# EasyEDA Pro project 通信扩展spi_usb_iic.epro

# Schematic 通信扩展spi_usb_iic

## Sheets
1 USB: Board Name: 通信板扩展; Create Date: 2025-05-26; Page Name: USB; Project Name: stm32f407zgTx系统板V2.0（自画 10mil）; Schematic Name: Schematic3; Update Date: 2025-06-02; Company: 嘉立创EDA; Page Size: A4; Version: V1.0
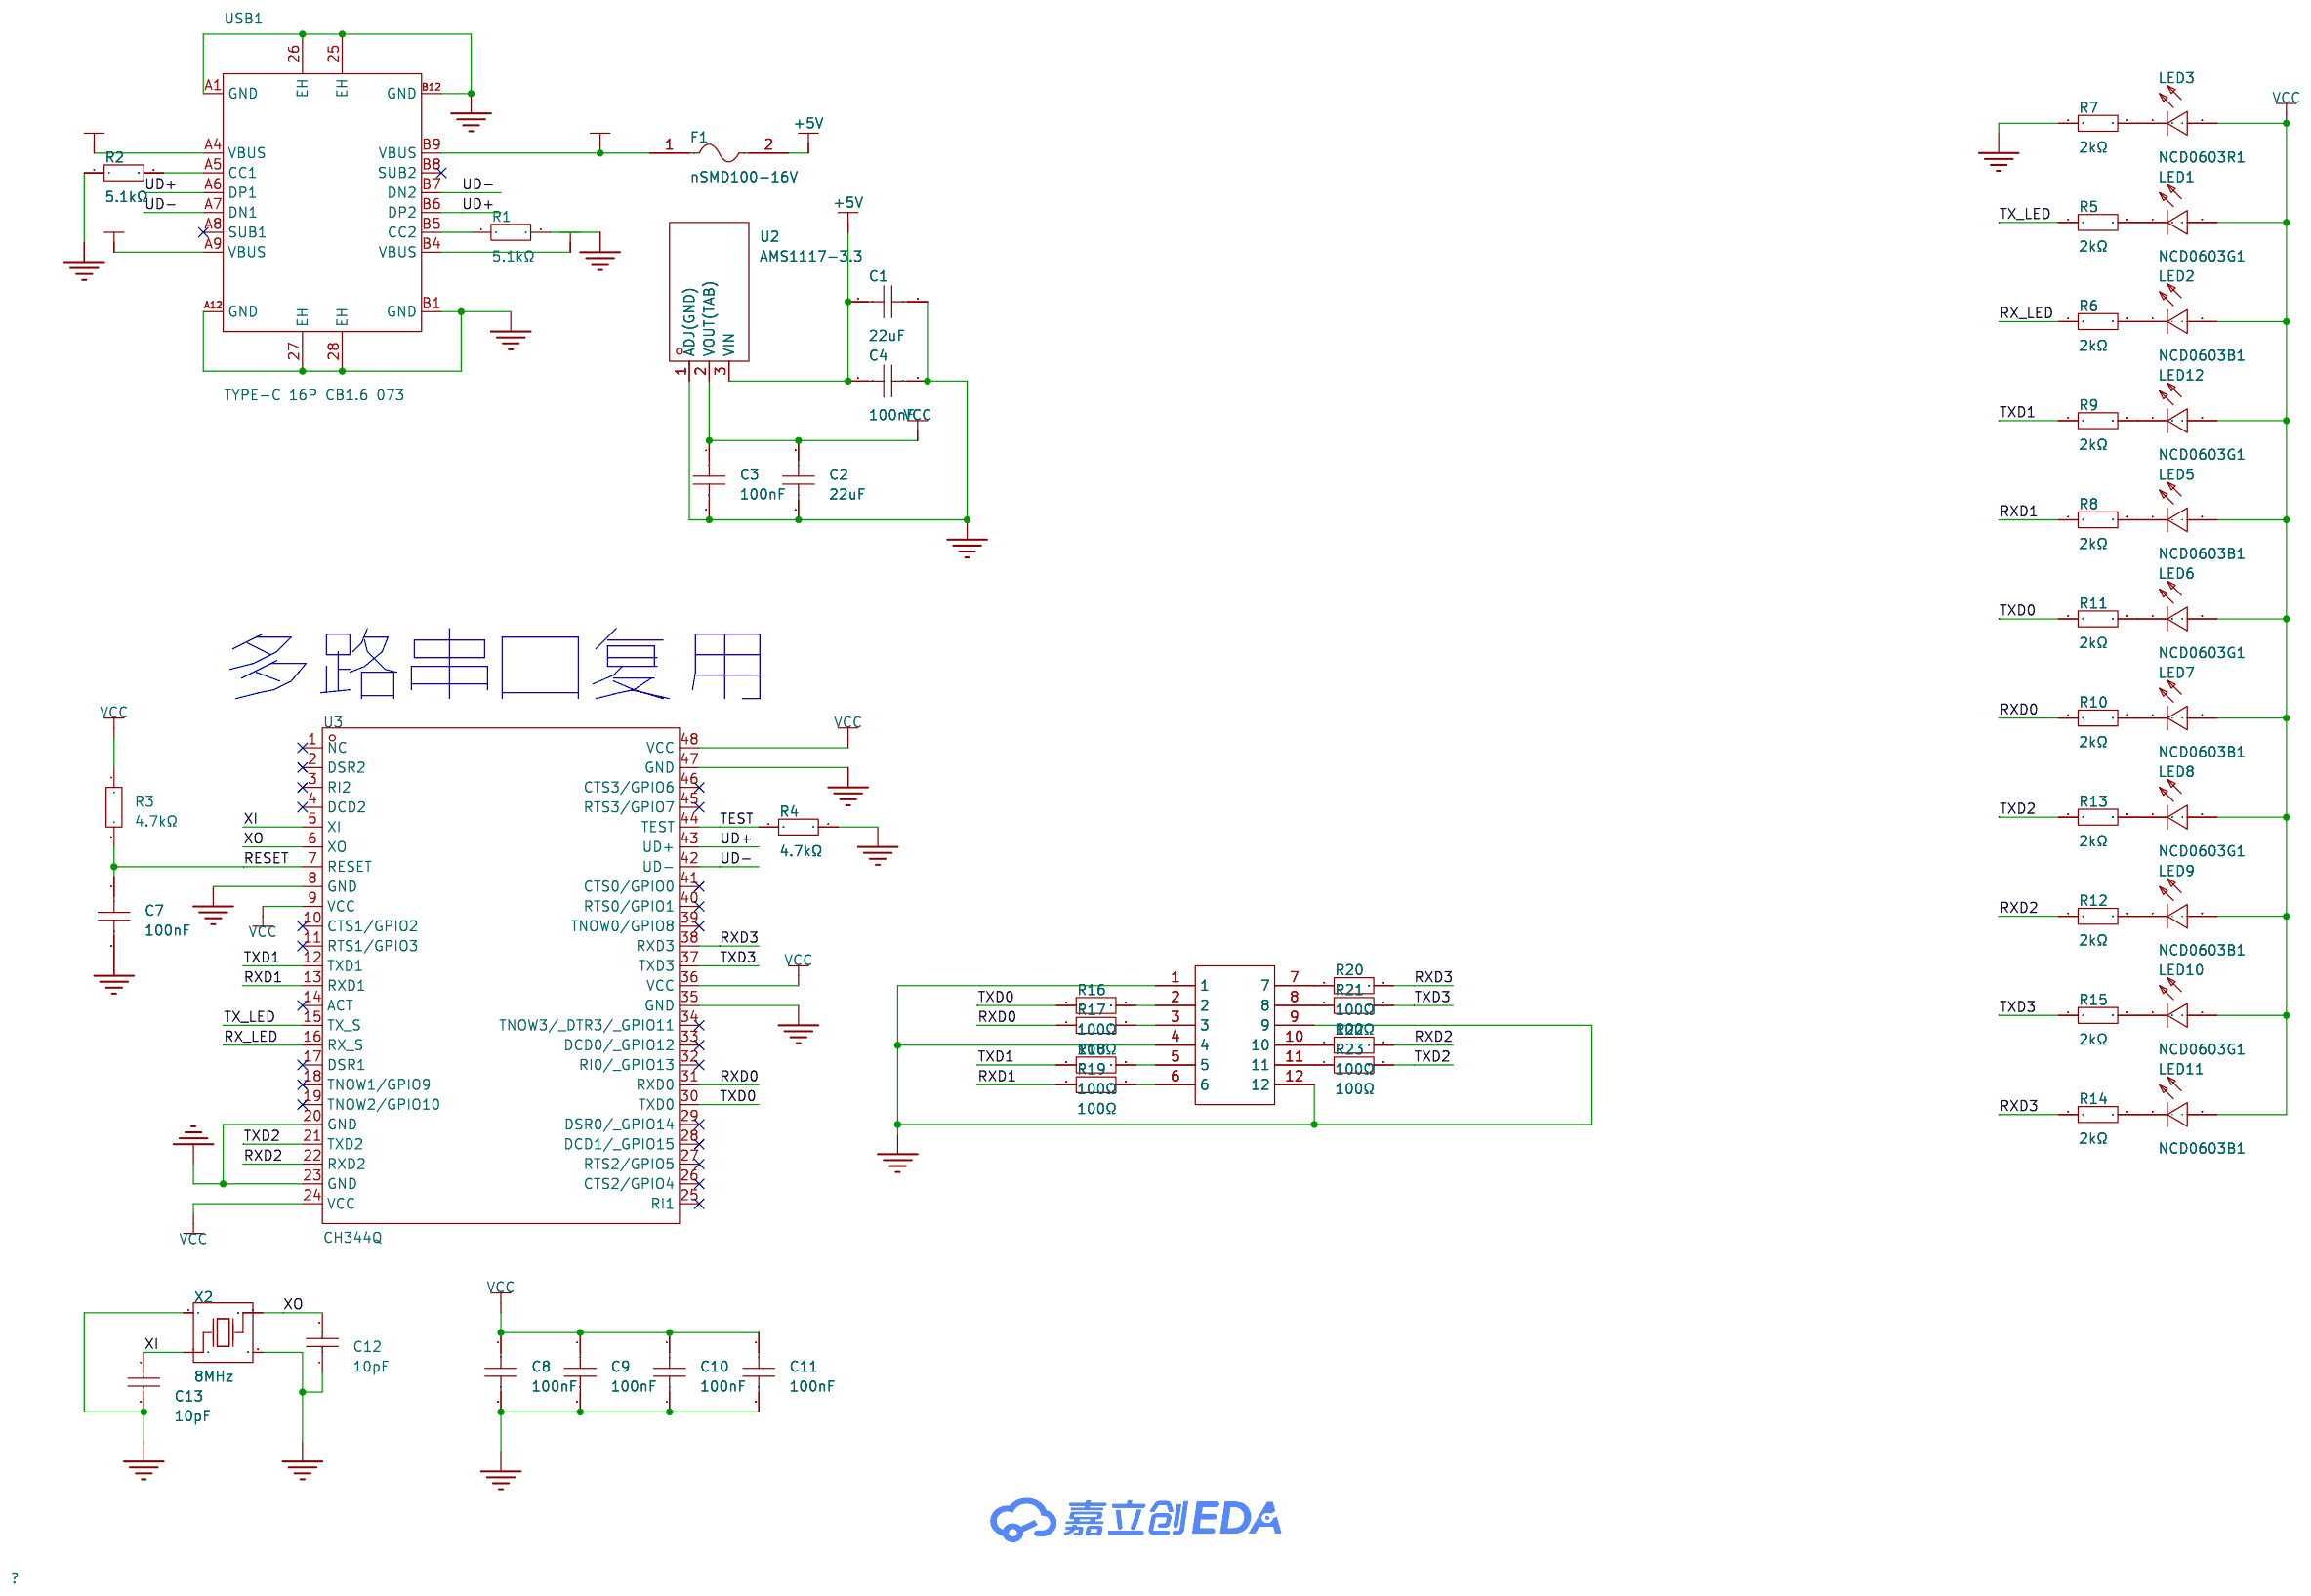
[diagram p0: USB]
2 IIC: Create Date: 2025-06-02; Page Name: IIC
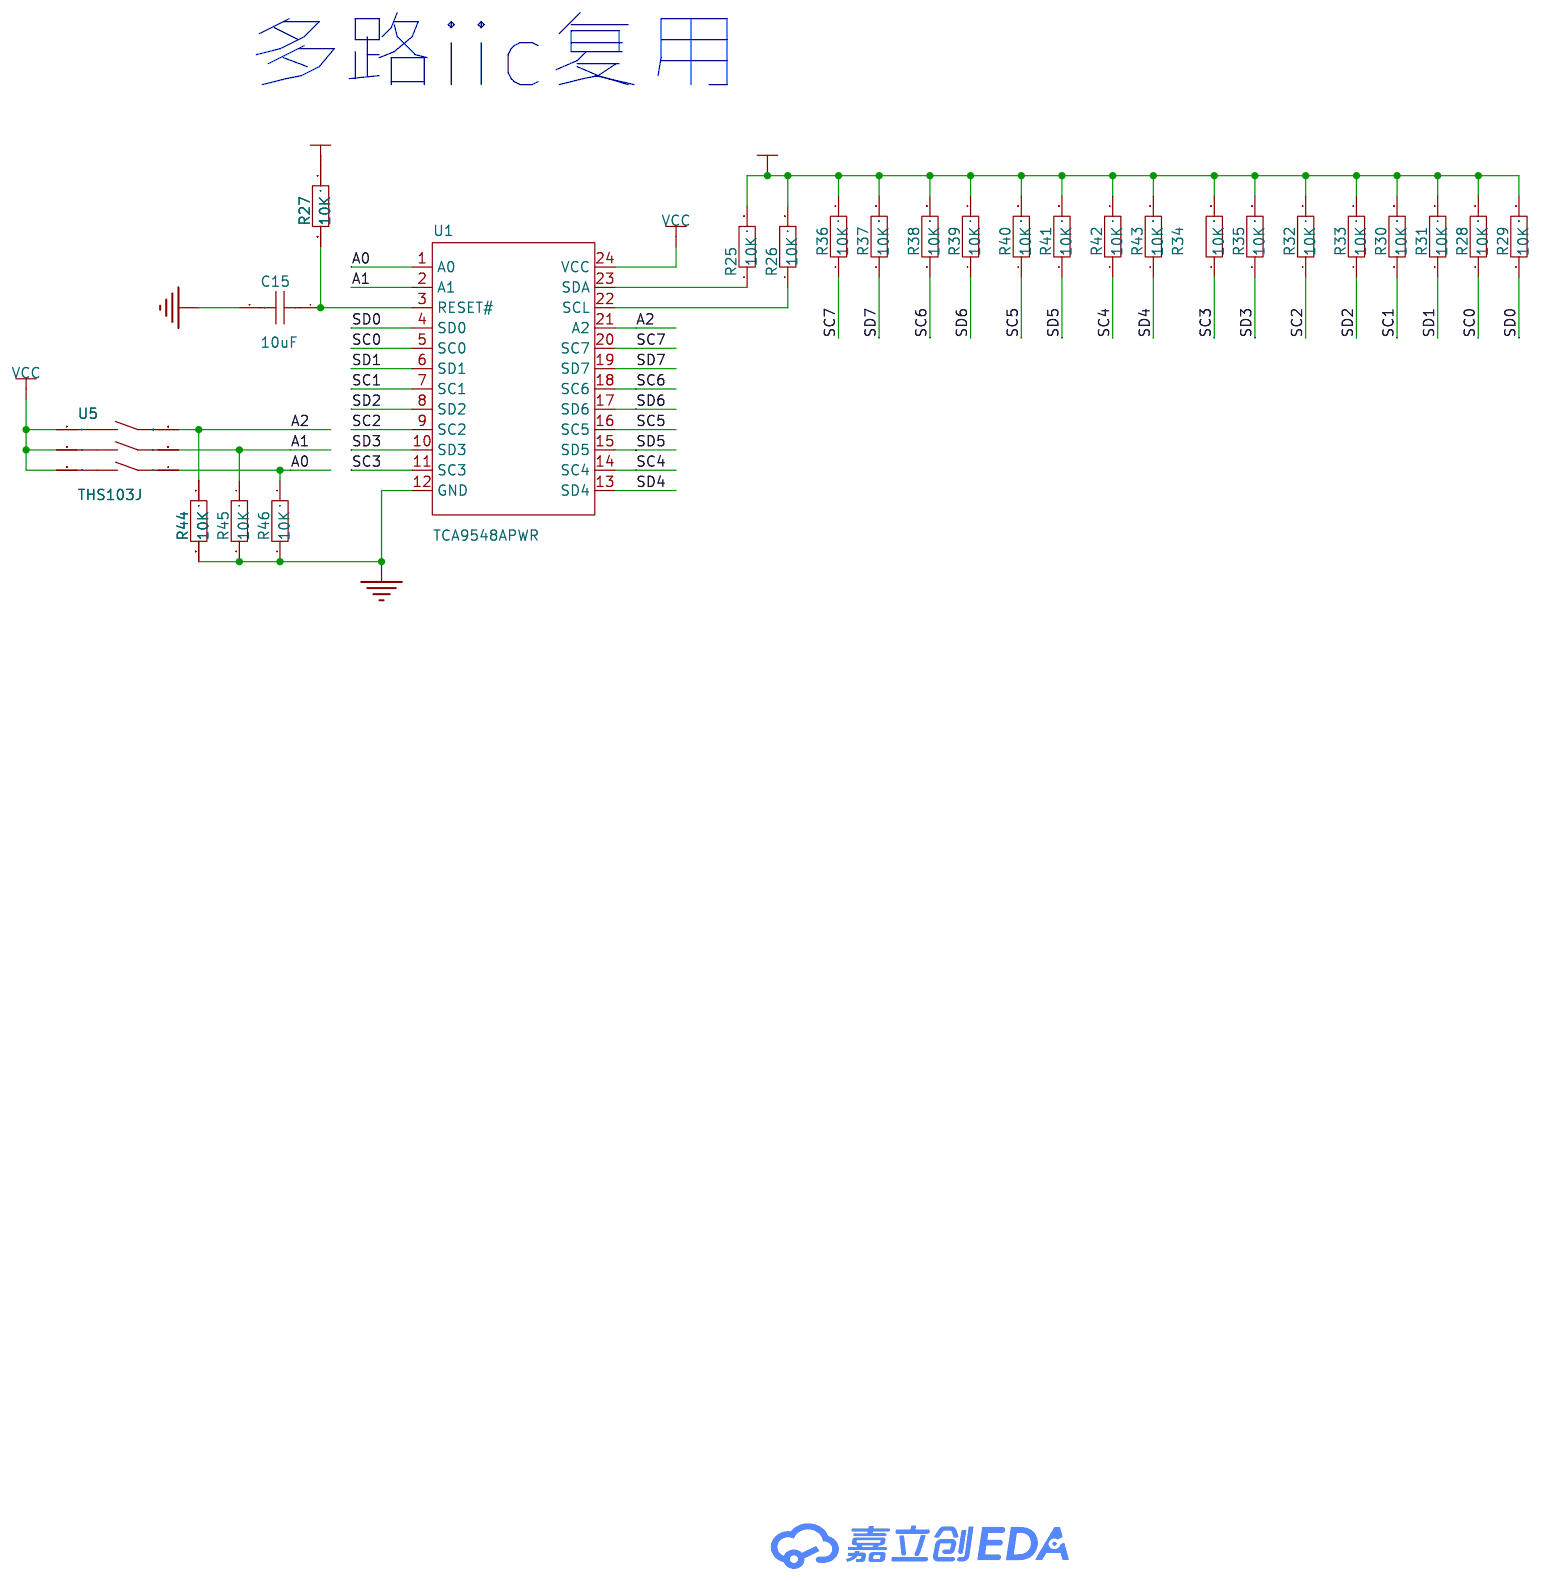
[diagram p1: IIC]
3 SPI: Create Date: 2025-06-02; Page Name: SPI
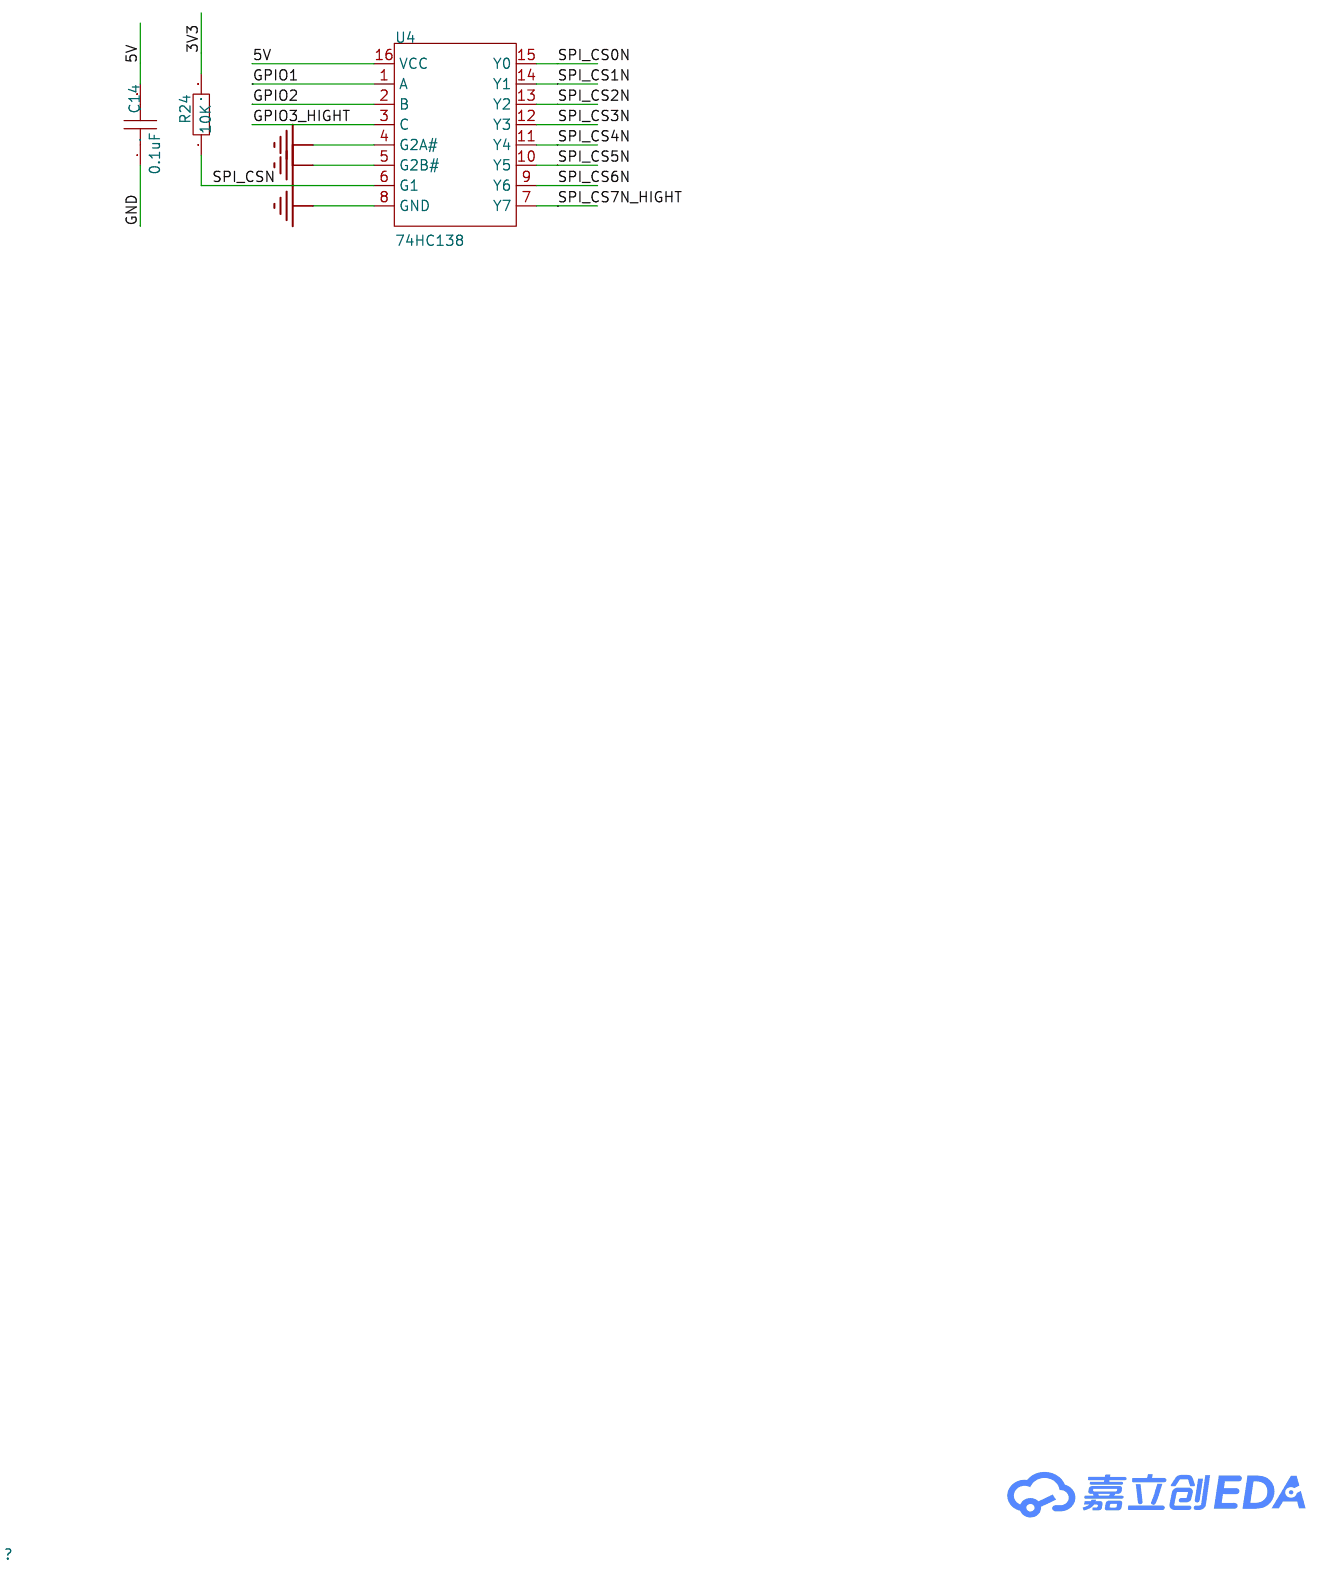
[diagram p2: SPI]

## Parts
sheet IIC
C15  10uF  [C0603]
R25  10K  [R0603]
R26  10K  [R0603]
R27  10K  [R0603]
R28  10K  [R0603]
R29  10K  [R0603]
R30  10K  [R0603]
R31  10K  [R0603]
R32  10K  [R0603]
R33  10K  [R0603]
R34  10K  [R0603]
R35  10K  [R0603]
R36  10K  [R0603]
R37  10K  [R0603]
R38  10K  [R0603]
R39  10K  [R0603]
R40  10K  [R0603]
R41  10K  [R0603]
R42  10K  [R0603]
R43  10K  [R0603]
R44  10K  [R0603]
R45  10K  [R0603]
R46  10K  [R0603]
U1  TCA9548APWR  [TSSOP-24_L7.8-W4.4-P0.65-LS6.4-BL]
U5  THS103J  [SW-SMD_6P-L5.4-W5.4-P1.27-LS5.6]
sheet SPI
C14  0.1uF  [C0603]  (no BOM)
R24  10K  [R0603]  (no BOM)
U4  74HC138  [SOP-16_L10.0-W3.9-P1.27-LS6.0-BL]  (no BOM)
sheet USB
C1  22uF  [C0805]  (no BOM)
C2  22uF  [C0805]  (no BOM)
C3  100nF  [C0603]  (no BOM)
C4  100nF  [C0603]  (no BOM)
C7  100nF  [C0603]  (no BOM)
C8  100nF  [C0603]  (no BOM)
C9  100nF  [C0603]  (no BOM)
C10  100nF  [C0603]  (no BOM)
C11  100nF  [C0603]  (no BOM)
C12  10pF  [C0603]  (no BOM)
C13  10pF  [C0603]  (no BOM)
F1  nSMD100-16V  [F1206]  (no BOM)
LED1  NCD0603G1  [LED0603-RD_1]  (no BOM)
LED2  NCD0603B1  [LED0603-RD]  (no BOM)
LED3  NCD0603R1  [LED0603-RD_RED]  (no BOM)
LED5  NCD0603B1  [LED0603-RD]  (no BOM)
LED6  NCD0603G1  [LED0603-RD_1]  (no BOM)
LED7  NCD0603B1  [LED0603-RD]  (no BOM)
LED8  NCD0603G1  [LED0603-RD_1]  (no BOM)
LED9  NCD0603B1  [LED0603-RD]  (no BOM)
LED10  NCD0603G1  [LED0603-RD_1]  (no BOM)
LED11  NCD0603B1  [LED0603-RD]  (no BOM)
LED12  NCD0603G1  [LED0603-RD_1]  (no BOM)
P2  -  [PAD_S_2.54_2*6]  (no BOM)
R1  5.1kΩ  [R0603]  (no BOM)
R2  5.1kΩ  [R0603]  (no BOM)
R3  4.7kΩ  [R0603]  (no BOM)
R4  4.7kΩ  [R0603]  (no BOM)
R5  2kΩ  [R0603]  (no BOM)
R6  2kΩ  [R0603]  (no BOM)
R7  2kΩ  [R0603]  (no BOM)
R8  2kΩ  [R0603]  (no BOM)
R9  2kΩ  [R0603]  (no BOM)
R10  2kΩ  [R0603]  (no BOM)
R11  2kΩ  [R0603]  (no BOM)
R12  2kΩ  [R0603]  (no BOM)
R13  2kΩ  [R0603]  (no BOM)
R14  2kΩ  [R0603]  (no BOM)
R15  2kΩ  [R0603]  (no BOM)
R16  100Ω  [R0603]  (no BOM)
R17  100Ω  [R0603]  (no BOM)
R18  100Ω  [R0603]  (no BOM)
R19  100Ω  [R0603]  (no BOM)
R20  100Ω  [R0603]  (no BOM)
R21  100Ω  [R0603]  (no BOM)
R22  100Ω  [R0603]  (no BOM)
R23  100Ω  [R0603]  (no BOM)
U2  AMS1117-3.3  [SOT-89_L4.5-W2.5-P1.50-LS4.2-BR]  (no BOM)
U3  CH344Q  [LQFP-48_L7.0-W7.0-P0.50-LS9.0-BL]  (no BOM)
USB1  TYPE-C 16P CB1.6 073  [USB-C-SMD_SHOU_TYPE-C-16P-CB1.6]  (no BOM)
X2  8MHz  [CRYSTAL-SMD_4P-L3.2-W2.5-BL]  (no BOM)

## Library data of the parts
C14 C15 = CAP_0603: Supplier Footprint: 0603
R24-R46 = Res_0603: Supplier Footprint: 0603
U1 = TCA9548APWR: TCA9548A 具有复位和电压转换的 8 通道、1.65V 至 5.5V I2C/SMBus 开关; Supplier Part: C130026; Manufacturer: TI(德州仪器); Supplier Footprint: TSSOP-24; JLCPCB Part Class: 扩展库; Datasheet: https://www.ti.com/cn/lit/gpn/tca9548a; Supplier: LCSC
U5 = THS103J: 类型:平拨,凹槽式;电路结构:单刀单掷;开关位数:3位;额定电流:25mA;额定电压:24V;使用寿命:3千次;颜色:黑色;; LCSC Part Name: 1.27间距 3P 拨码开关 轻触开关; Supplier Part: C5289932; Manufacturer: ROCPU Switches(台普); Supplier Footprint: SMD; JLCPCB Part Class: 扩展库; Datasheet: https://atta.szlcsc.com/upload/public/pdf/source/20221125/9AAD44A909D378363CC7D2134969B4CC.pdf; Supplier: LCSC; Type: 平拨,凹槽式; Circuit: 单刀单掷; Number of Positions: 3位; Lead Pitch: 1.27mm; Current Rating: 25mA; Voltage Rating: 24V; Operating Temperature: -30℃~+85℃; Operating Life: 3千次; Color: 黑色
U4 = 74HC138_C18164491: 供电电压:2V~6V;线路数:3~8;灌电流(IOL):5.2mA;拉电流(IOH):5.2mA;; Supplier Part: C18164491; Manufacturer: GR(国睿); Supplier Footprint: SOP-16; JLCPCB Part Class: Extended Part; Datasheet: https://atta.szlcsc.com/upload/public/pdf/source/20230915/1875FD9BBCBC078FA2EE33B300B49074.pdf; Supplier: LCSC; Type: 译码器; Voltage Supply Source: 单电源; Supply Voltage: 2V~6V; Number of lines: 3~8; Sink Current: 5.2mA; Source Current: 5.2mA; Operating temperature: 0℃~+70℃
C1 C2 = CL21A226MAQNNNE: 容值:22uF;精度:±20%;额定电压:25V;材质(温度系数):X5R;; LCSC Part Name: 22uF ±20% 25V; Supplier Part: C45783; Manufacturer: SAMSUNG(三星); Supplier Footprint: 0805; JLCPCB Part Class: 基础库; Datasheet: https://atta.szlcsc.com/upload/public/pdf/source/20160218/1457707763339.pdf; Supplier: LCSC; Tolerance: ±20%; Voltage Rated: 25V; Temperature Coefficient: X5R
C3 C4 C7-C11 = CL10B104KB8NNNC: 容值:100nF;精度:±10%;额定电压:50V;材质(温度系数):X7R;; LCSC Part Name: 100nF ±10% 50V; Supplier Part: C1591; Manufacturer: SAMSUNG(三星); Supplier Footprint: 0603; JLCPCB Part Class: 扩展库; Datasheet: https://atta.szlcsc.com/upload/public/pdf/source/20160218/1457707763339.pdf; Supplier: LCSC; Tolerance: ±10%; Voltage Rated: 50V; Temperature Coefficient: X7R
C12 C13 = CL10C100JB8NNNC: 容值:10pF;精度:±5%;额定电压:50V;材质(温度系数):C0G;; LCSC Part Name: 10pF ±5% 50V; Supplier Part: C1634; Manufacturer: SAMSUNG(三星); Supplier Footprint: 0603; JLCPCB Part Class: 基础库; Datasheet: https://atta.szlcsc.com/upload/public/pdf/source/20160218/1457707763339.pdf; Supplier: LCSC; Tolerance: ±5%; Voltage Rated: 50V; Temperature Coefficient: C0G
F1 = nSMD100-16V: 最大电压:16V;最大电流:100A;保持电流:1A;跳闸电流:1.8A;; LCSC Part Name: 16V 1A 1206自恢复; Supplier Part: C70082; Manufacturer: 台湾陆海; Supplier Footprint: 1206; JLCPCB Part Class: 扩展库; Datasheet: https://atta.szlcsc.com/upload/public/pdf/source/20230404/79E9D987C95B794CE9DCBF976052DB19.pdf; Supplier: LCSC; Operating Voltage (Max): 16V; Current Rating (Max): 100A; Hold Current: 1A; Trip Current: 1.8A
LED1 LED6 LED8 LED10 LED12 = NCD0603G1: 发光颜色:翠绿色;正向电压(VF):2.6V~3.6V;功率:72mW;正向电流:10mA;主波长:515nm~530nm;透镜颜色:无色透明透镜;发光强度:330mcd~900mcd;发光角度:130°;工作温度:-30℃~+85℃;; Supplier Part: C84267; Manufacturer: 国星光电; Supplier Footprint: 0603; JLCPCB Part Class: 扩展库; Datasheet: https://atta.szlcsc.com/upload/public/pdf/source/20200820/C84267_04BA7703640BAC111D09F5EFB971FBF3.pdf; Supplier: LCSC; Emitted Color: 翠绿色; Forward Voltage (VF): 2.6V~3.6V; Power Dissipation: 72mW; Forward Current: 10mA; Dominant Wavelength: 515nm~530nm; Lens Color: 无色透明透镜; Luminous Intensity: 330mcd~900mcd; Viewing Angle: 130°; Operating Temperature: -30℃~+85℃
LED2 LED5 LED7 LED9 LED11 = NCD0603B1: 发光颜色:蓝色;正向电压(VF):2.6V~3.6V;功率:72mW;正向电流:10mA;主波长:463nm~475nm;透镜颜色:无色透明透镜;发光强度:80mcd~220mcd;发光角度:130°;工作温度:-30℃~+85℃;; Supplier Part: C84266; Manufacturer: 国星光电; Supplier Footprint: 0603; JLCPCB Part Class: 扩展库; Datasheet: https://atta.szlcsc.com/upload/public/pdf/source/20200820/C84266_6A3CDBEFA72C6CAD68EDA53474ADAE6C.pdf; Supplier: LCSC; Emitted Color: 蓝色; Forward Voltage (VF): 2.6V~3.6V; Power Dissipation: 72mW; Forward Current: 10mA; Dominant Wavelength: 463nm~475nm; Lens Color: 无色透明透镜; Luminous Intensity: 80mcd~220mcd; Viewing Angle: 130°; Operating Temperature: -30℃~+85℃
LED3 = NCD0603R1_C84263: 灯头类型:-;发光颜色:红色;正向电压(VF):1.6V~2.6V;功率:65mW;正向电流:20mA;主波长:615nm~630nm;二极管配置:独立二极管;透镜颜色:无色透明透镜;色温:-;发光强度:80mcd~220mcd;发光角度:130°;载带方式:-;工作温度:-30℃~+85℃;; Supplier Part: C84263; Manufacturer: 国星光电; Supplier Footprint: 0603; JLCPCB Part Class: 扩展库; Datasheet: https://atta.szlcsc.com/upload/public/pdf/source/20200820/C84263_DABC6A75E58F576973B407FDBA283D60.pdf; Supplier: LCSC; Emitted Color: 红色; Forward Voltage (VF): 1.6V~2.6V; Power Dissipation: 65mW; Forward Current: 20mA; Dominant Wavelength: 615nm~630nm; Diode Configuration: 独立二极管; Lens Color: 无色透明透镜; Luminous Intensity: 80mcd~220mcd; Viewing Angle: 130°; Operating Temperature: -30℃~+85℃
P2 = PAD_S_2.54_2*6
R1 R2 = 0603WAF5101T5E: 电阻类型:厚膜电阻;阻值:5.1kΩ;精度:±1%;功率:100mW;最大工作电压:75V;温度系数:±100ppm/℃;; LCSC Part Name: 5.1kΩ ±1% 100mW 厚膜电阻; Supplier Part: C23186; Manufacturer: UNI-ROYAL(厚声); Supplier Footprint: 0603; JLCPCB Part Class: 基础库; Datasheet: https://atta.szlcsc.com/upload/public/pdf/source/20200306/C422600_1E6D84923E4A46A82E41ADD87F860B5C.pdf; Supplier: LCSC; Type: 厚膜电阻; Tolerance: ±1%; Power(Watts): 100mW; Overload Voltage (Max): 75V; Temperature Coefficient: ±100ppm/℃; Operating Temperature Range: -55℃~+155℃
R3 R4 = 0603WAF4701T5E: 电阻类型:厚膜电阻;阻值:4.7kΩ;精度:±1%;功率:100mW;最大工作电压:75V;温度系数:±100ppm/℃;; LCSC Part Name: 4.7kΩ ±1% 100mW 厚膜电阻; Supplier Part: C23162; Manufacturer: UNI-ROYAL(厚声); Supplier Footprint: 0603; JLCPCB Part Class: 基础库; Datasheet: https://atta.szlcsc.com/upload/public/pdf/source/20200306/C422600_1E6D84923E4A46A82E41ADD87F860B5C.pdf; Supplier: LCSC; Type: 厚膜电阻; Tolerance: ±1%; Power(Watts): 100mW; Overload Voltage (Max): 75V; Temperature Coefficient: ±100ppm/℃; Operating Temperature Range: -55℃~+155℃
R5-R15 = 0603WAF2001T5E: 电阻类型:厚膜电阻;阻值:2kΩ;精度:±1%;功率:100mW;最大工作电压:75V;温度系数:±100ppm/℃;; LCSC Part Name: 2kΩ ±1% 100mW 厚膜电阻; Supplier Part: C22975; Manufacturer: UNI-ROYAL(厚声); Supplier Footprint: 0603; JLCPCB Part Class: 基础库; Datasheet: https://atta.szlcsc.com/upload/public/pdf/source/20200306/C422600_1E6D84923E4A46A82E41ADD87F860B5C.pdf; Supplier: LCSC; Type: 厚膜电阻; Tolerance: ±1%; Power(Watts): 100mW; Overload Voltage (Max): 75V; Temperature Coefficient: ±100ppm/℃; Operating Temperature Range: -55℃~+155℃
R16-R23 = 0603WAF1000T5E: 电阻类型:厚膜电阻;阻值:100Ω;精度:±1%;功率:100mW;最大工作电压:75V;温度系数:±200ppm/℃;; LCSC Part Name: 100Ω ±1% 100mW 厚膜电阻; Supplier Part: C22775; Manufacturer: UNI-ROYAL(厚声); Supplier Footprint: 0603; JLCPCB Part Class: 基础库; Datasheet: https://atta.szlcsc.com/upload/public/pdf/source/20200306/C422600_1E6D84923E4A46A82E41ADD87F860B5C.pdf; Supplier: LCSC; Type: 厚膜电阻; Tolerance: ±1%; Power(Watts): 100mW; Overload Voltage (Max): 75V; Temperature Coefficient: ±200ppm/℃; Operating Temperature Range: -55℃~+155℃
U2 = AMS1117-3.3_C347256: 输出类型:固定;工作电压:18V;输出电压:3.3V;输出电流:1A;电源纹波抑制比(PSRR):60dB@(120Hz);输出极性:正极;; LCSC Part Name: 输出:3.3V 电流:1A 耐压:12V; Supplier Part: C347256; Manufacturer: UMW(友台半导体); Supplier Footprint: SOT-89; JLCPCB Part Class: 扩展库; Datasheet: https://atta.szlcsc.com/upload/public/pdf/source/20241218/BAF0263FA2E44BCD8AF41AA4FA04EFAA.pdf; Supplier: LCSC; Output Type: 固定; Maximum Input Voltage: 18V; Output Voltage: 3.3V; Output Current: 1A; Power Supply Rejection Ratio (PSRR): 60dB@(120Hz); Dropout Voltage: 1.3V@(1A); Feature: 过流保护(OCP); Output Polarity: 正极; Number of Outputs: 1
U3 = CH344Q: 应用功能:USB转UART；USB转RS485；USB转RS422；USB转RS232;接口协议:USB 3.0;通道数:4;数据速率:6Mbps;; LCSC Part Name: CH344手册 USB转4串口芯片CH344; Supplier Part: C2988084; Manufacturer: WCH(南京沁恒); Supplier Footprint: LQFP-48(7x7); JLCPCB Part Class: 扩展库; Datasheet: https://atta.szlcsc.com/upload/public/pdf/source/20240313/7DE30B72CEBDB31E7B30C99535C8F9D9.pdf; Supplier: LCSC; Applications Function: USB转UART；USB转RS485；USB转RS422；USB转RS232; Protocol: USB 3.0; Number of Channels: 4; Supply Voltage: 3.3V; Data Rate: 6Mbps; Operating Temperature: -40℃~+85℃
USB1 = TYPE-C 16P CB1.6 073: 连接器类型:Type-C;标准:USB 3.1;公母:母;安装方式:沉板;触点数量:16P;端口数量:1;额定电流 - 电源:3A;工作温度范围:-25℃~+85℃;; LCSC Part Name: Type-C 母 沉板; Supplier Part: C2906290; Manufacturer: SHOU HAN(首韩); Supplier Footprint: SMD; JLCPCB Part Class: 扩展库; Datasheet: https://atta.szlcsc.com/upload/public/pdf/source/20211021/35D048B933FA988260DD32545575C1A5.pdf; Supplier: LCSC; Connector Type: Type-C; Standard: USB 3.1; Gender: 母; Mounting Style: 沉板; Number of Contacts: 16P; Number of Ports: 1; Current Rating - Power (Max): 3A; Operating Temperature Range: -25℃~+85℃; Rated Voltage (Max): 5V; Connect-Disconnect Life: 5千次; Core Colour: 黑色
X2 = TAXM8M4RDBCCT2T: 晶振类型:贴片晶振;频率:8MHz;常温频差:±10ppm;负载电容:10pF;频率稳定度(全温):±15ppm;; LCSC Part Name: 8MHz ±10ppm 10pF; Supplier Part: C400090; Manufacturer: YJX(雅晶鑫); Supplier Footprint: SMD3225-4P; JLCPCB Part Class: 扩展库; Datasheet: https://atta.szlcsc.com/upload/public/pdf/source/20190626/C400090_CF95B89E745AFE4EF2E392EF8AC009D6.pdf; Supplier: LCSC; Crystal Type: 贴片晶振; Normal temperature Frequency Tolerance: ±10ppm; Load Capacitor: 10pF; Frequency Stability(Full temperature range): ±15ppm; Equivalent Series Resistance (ESR): 250Ω; Operating Temperature: -40℃~+85℃

## Nets
3V3: R24.2 R25.2 R26.2 R27.1 R28.2 R29.2 R30.2 R31.2 R32.2 R33.2 R34.2 R35.2 R36.2 R37.2 R38.2 R39.2 R40.2 R41.2 R42.2 R43.2
5V: C14.2 U4.16(VCC)
+5V: C1.1 C4.1 F1.2 U2.3(VIN)
GND: C1.2 C2.1 C3.2 C4.2 C7.2 C8.2 C9.2 C10.2 C11.2 C12.2 C13.2 C14.1 C15.2 P2.1 P2.4 P2.9 P2.12 R1.2 R2.1 R4.1 R7.1 R44.2 R45.2 R46.2 U1.12(GND) U2.1(ADJ(GND)) U3.8(GND) U3.20(GND) U3.23(GND) U3.35(GND) U3.47(GND) U4.4(G2A#) U4.5(G2B#) U4.8(GND) USB1.25(EH) USB1.26(EH) USB1.27(EH) USB1.28(EH) USB1.A1(GND) USB1.A12(GND) USB1.B1(GND) USB1.B12(GND) X2.2 X2.4
VBUS: F1.1 USB1.A4(VBUS) USB1.A9(VBUS) USB1.B4(VBUS) USB1.B9(VBUS)
VCC: C2.2 C3.1 C8.1 C9.1 C10.1 C11.1 LED1.2(A) LED2.2(+) LED3.2(A) LED5.2(+) LED6.2(A) LED7.2(+) LED8.2(A) LED9.2(+) LED10.2(A) LED11.2(+) LED12.2(A) R3.2 U1.24(VCC) U2.2(VOUT(TAB)) U3.9(VCC) U3.24(VCC) U3.36(VCC) U3.48(VCC) U5.1 U5.2 U5.3
A0: R46.1 U1.1(A0) U5.4
A1: R45.1 U1.2(A1) U5.5
A2: R44.1 U1.21(A2) U5.6
GPIO1: U4.1(A)
GPIO2: U4.2(B)
GPIO3_HIGHT: U4.3(C)
RESET: C7.1 R3.1 U3.7(RESET)
RX_LED: R6.1 U3.16(RX_S)
RXD0: R10.1 R17.1 U3.31(RXD0)
RXD1: R8.1 R19.1 U3.13(RXD1)
RXD2: R12.1 R22.2 U3.22(RXD2)
RXD3: R14.1 R20.2 U3.38(RXD3)
SC0: R28.1 U1.5(SC0)
SC1: R30.1 U1.7(SC1)
SC2: R32.1 U1.9(SC2)
SC3: R34.1 U1.11(SC3)
SC4: R42.1 U1.14(SC4)
SC5: R40.1 U1.16(SC5)
SC6: R38.1 U1.18(SC6)
SC7: R36.1 U1.20(SC7)
SD0: R29.1 U1.4(SD0)
SD1: R31.1 U1.6(SD1)
SD2: R33.1 U1.8(SD2)
SD3: R35.1 U1.10(SD3)
SD4: R43.1 U1.13(SD4)
SD5: R41.1 U1.15(SD5)
SD6: R39.1 U1.17(SD6)
SD7: R37.1 U1.19(SD7)
SPI_CS0N: U4.15(Y0)
SPI_CS1N: U4.14(Y1)
SPI_CS2N: U4.13(Y2)
SPI_CS3N: U4.12(Y3)
SPI_CS4N: U4.11(Y4)
SPI_CS5N: U4.10(Y5)
SPI_CS6N: U4.9(Y6)
SPI_CS7N_HIGHT: U4.7(Y7)
SPI_CSN: R24.1 U4.6(G1)
TEST: R4.2 U3.44(TEST)
TX_LED: R5.1 U3.15(TX_S)
TXD0: R11.1 R16.1 U3.30(TXD0)
TXD1: R9.1 R18.1 U3.12(TXD1)
TXD2: R13.1 R23.2 U3.21(TXD2)
TXD3: R15.1 R21.2 U3.37(TXD3)
UD+: U3.43(UD+) USB1.A6(DP1) USB1.B6(DP2)
UD-: U3.42(UD-) USB1.A7(DN1) USB1.B7(DN2)
XI: C13.1 U3.5(XI) X2.1
XO: C12.1 U3.6(XO) X2.3
$1N5363: R1.1 USB1.B5(CC2)
$1N5364: R2.2 USB1.A5(CC1)
$1N5436: LED2.1(-) R6.2
$1N5437: LED1.1(K) R5.2
$1N5438: LED3.1(K) R7.2
$1N5443: LED5.1(-) R8.2
$1N5448: LED7.1(-) R10.2
$1N5449: LED6.1(K) R11.2
$1N5454: LED9.1(-) R12.2
$1N5455: LED8.1(K) R13.2
$1N5460: LED11.1(-) R14.2
$1N5461: LED10.1(K) R15.2
$1N5479: P2.2 R16.2
$1N5482: P2.3 R17.2
$1N5485: P2.5 R18.2
$1N5488: P2.6 R19.2
$1N5489: P2.7 R20.1
$1N5490: P2.8 R21.1
$1N5491: P2.10 R22.1
$1N5492: P2.11 R23.1
$1N5493: LED12.1(K) R9.2
$2N688: R25.1 U1.23(SDA)
$2N692: R26.1 U1.22(SCL)
$2N770: C15.1 R27.2 U1.3(RESET#)

Not connected (* = marked no-connect by the designer): U3 1(NC)* 2(DSR2)* 3(RI2)* 4(DCD2)* 10(CTS1/GPIO2)* 11(RTS1/GPIO3)* 14(ACT)* 17(DSR1)* 18(TNOW1/GPIO9)* 19(TNOW2/GPIO10)* 25(RI1)* 26(CTS2/GPIO4)* 27(RTS2/GPIO5)* 28(DCD1/ GPIO15)* 29(DSR0/ GPIO14)* 32(RI0/ GPIO13)* 33(DCD0/ GPIO12)* 34(TNOW3/ DTR3/ GPIO11)* 39(TNOW0/GPIO8)* 40(RTS0/GPIO1)* 41(CTS0/GPIO0)* 45(RTS3/GPIO7)* 46(CTS3/GPIO6)*; USB1 A8(SUB1)* B8(SUB2)*

## Notes on the sheets
sheet 1
- 多路串口复用
sheet 2
- 多路iic复用

# Board 通信扩展spi_usb_iic
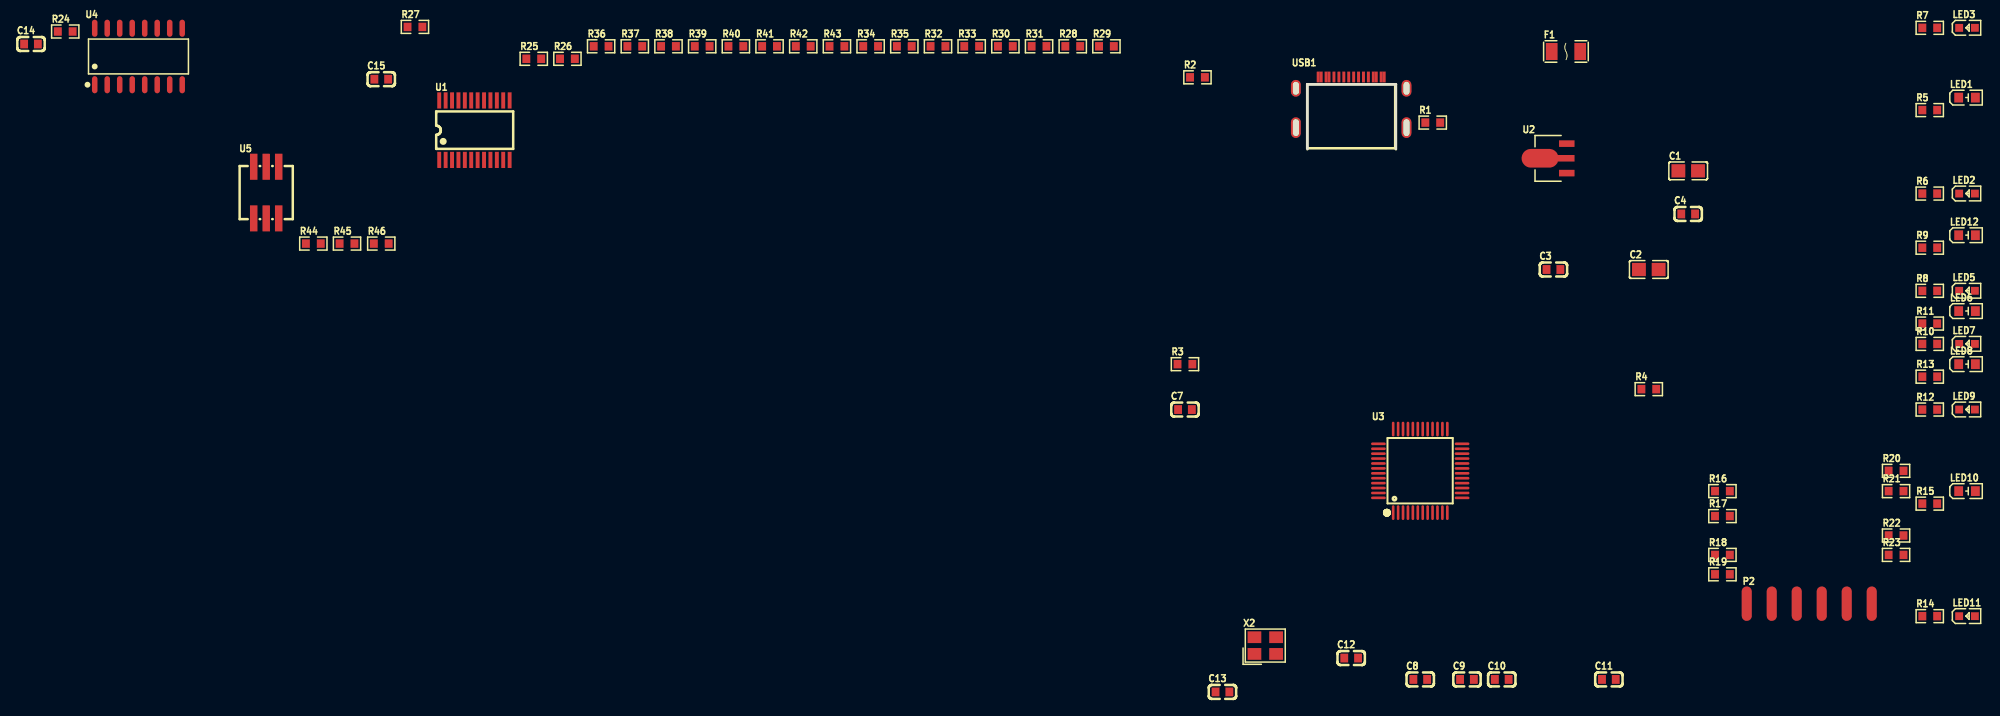
[diagram p3: board, top side]
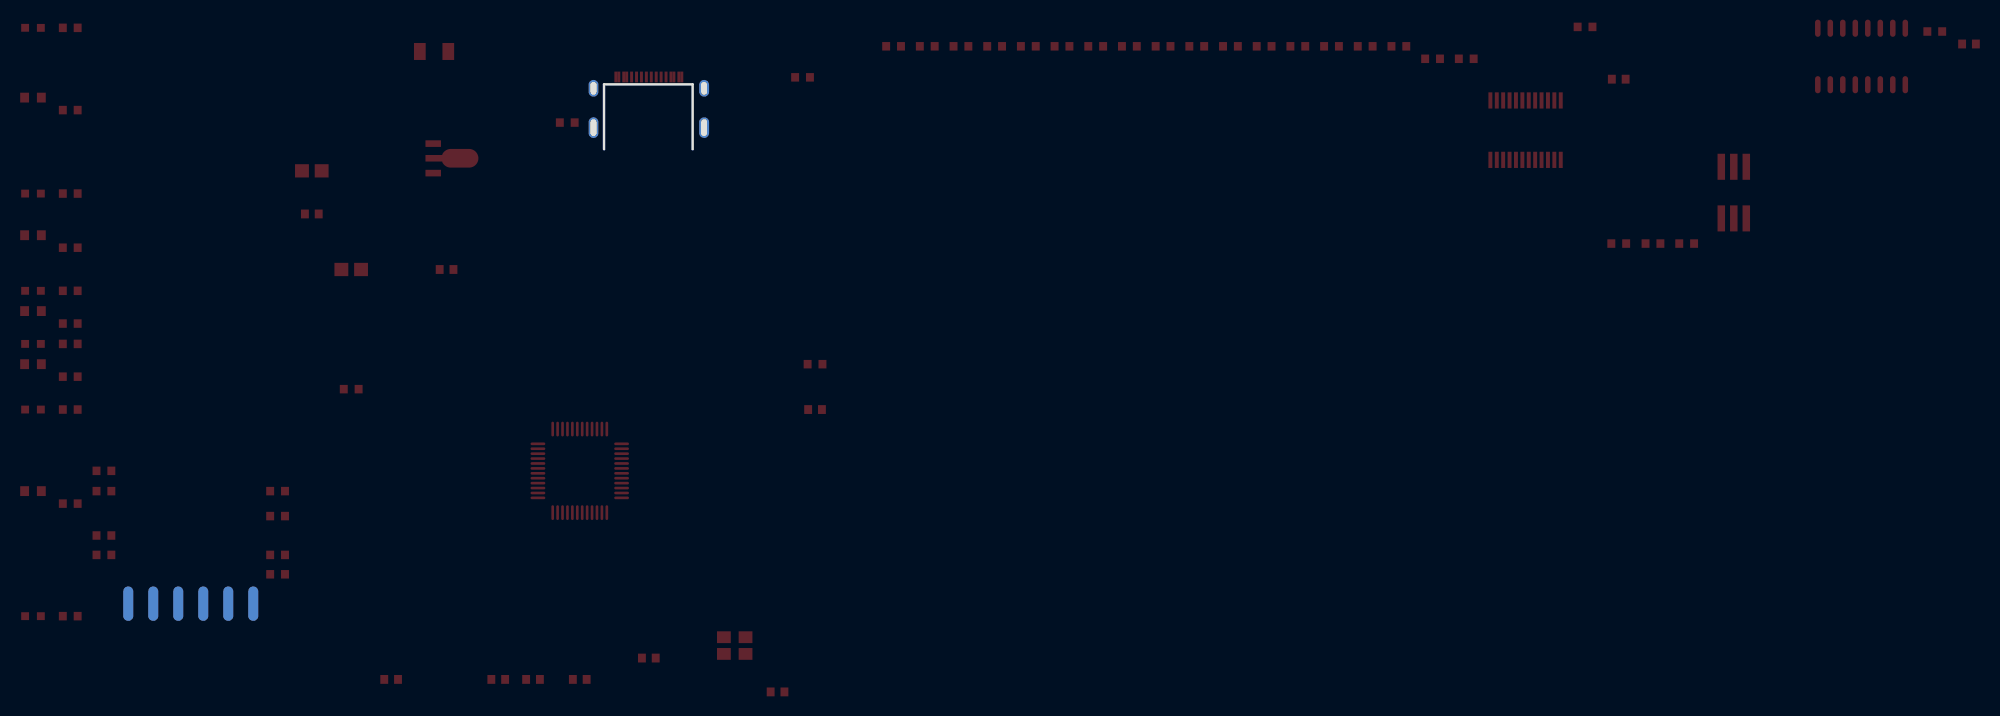
[diagram p4: board, bottom side, seen from below]

Outline 9 x 6.6 mm; copper layers: Top Layer, Bottom Layer. Coordinates in mm from the lower left corner of the outline.
Stack: Top Layer 0.035mm / Dielectric1 1.51mm FR4 er 4.5 / Bottom Layer 0.035mm

## Design rules (mm)
template: JLCPCB Capability(Two Layers Board)
spacing copperThickness1oz (default): track to track 0.102, other pairs 0.152 to 0.3
spacing copperThickness2oz: track to track 0.203, other pairs 0.152 to 0.3
track width copperThickness1oz (default): min 0.127, default 0.254, max 2.54
track width copperThickness2oz: min 0.203, default 0.254, max 2.54
differential pair differentialPair (default): width min 0.127, default 0.254, max 2.54; gap min 0.152, default 0.152
via viaSize (default): diameter min 0.5, default 0.61, max 10; hole min 0.3, default 0.305, max 6.3

## Placement (name value [footprint] x y rotation side)
C1  22uF  [C0805]  38.69 -2.2 0 top
C2  22uF  [C0805]  34.69 -12.23 0 top
C3  100nF  [C0603]  25 -12.23 0 top
C4  100nF  [C0603]  38.69 -6.58 0 top
C7  100nF  [C0603]  -12.44 -26.47 0 top
C8  100nF  [C0603]  11.47 -53.93 0 top
C9  100nF  [C0603]  16.22 -53.93 0 top
C10  100nF  [C0603]  19.75 -53.93 0 top
C11  100nF  [C0603]  30.63 -53.93 0 top
C12  10pF  [C0603]  4.45 -51.75 0 top
C13  10pF  [C0603]  -8.63 -55.2 0 top
C14  0.1uF  [C0603]  -129.68 10.71 0 top
C15  10uF  [C0603]  -94.09 7.13 0 top
F1  nSMD100-16V  [F1206]  26.27 9.95 0 top
LED1  NCD0603G1  [LED0603-RD_1]  67.02 5.25 0 top
LED2  NCD0603B1  [LED0603-RD]  67.02 -4.51 0 top
LED3  NCD0603R1  [LED0603-RD_RED]  67.02 12.35 0 top
LED5  NCD0603B1  [LED0603-RD]  67.02 -14.4 0 top
LED6  NCD0603G1  [LED0603-RD_1]  67.02 -16.46 0 top
LED7  NCD0603B1  [LED0603-RD]  67.02 -19.8 0 top
LED8  NCD0603G1  [LED0603-RD_1]  67.02 -21.86 0 top
LED9  NCD0603B1  [LED0603-RD]  67.02 -26.47 0 top
LED10  NCD0603G1  [LED0603-RD_1]  67.02 -34.77 0 top
LED11  NCD0603B1  [LED0603-RD]  67.02 -47.49 0 top
LED12  NCD0603G1  [LED0603-RD_1]  67.02 -8.74 0 top
P2  -  [PAD_S_2.54_2*6]  50.99 -46.22 0 top
R1  5.1kΩ  [R0603]  12.74 2.71 0 top
R2  5.1kΩ  [R0603]  -11.17 7.32 0 top
R3  4.7kΩ  [R0603]  -12.44 -21.86 0 top
R4  4.7kΩ  [R0603]  34.69 -24.4 0 top
R5  2kΩ  [R0603]  63.23 3.98 0 top
R6  2kΩ  [R0603]  63.23 -4.51 0 top
R7  2kΩ  [R0603]  63.23 12.35 0 top
R8  2kΩ  [R0603]  63.23 -14.4 0 top
R9  2kΩ  [R0603]  63.23 -10.01 0 top
R10  2kΩ  [R0603]  63.23 -19.8 0 top
R11  2kΩ  [R0603]  63.23 -17.73 0 top
R12  2kΩ  [R0603]  63.23 -26.47 0 top
R13  2kΩ  [R0603]  63.23 -23.13 0 top
R14  2kΩ  [R0603]  63.23 -47.49 0 top
R15  2kΩ  [R0603]  63.23 -36.04 0 top
R16  100Ω  [R0603]  42.17 -34.77 0 top
R17  100Ω  [R0603]  42.17 -37.31 0 top
R18  100Ω  [R0603]  42.17 -41.26 0 top
R19  100Ω  [R0603]  42.17 -43.23 0 top
R20  100Ω  [R0603]  59.81 -32.71 0 top
R21  100Ω  [R0603]  59.81 -34.77 0 top
R22  100Ω  [R0603]  59.81 -39.29 0 top
R23  100Ω  [R0603]  59.81 -41.26 0 top
R24  10K  [R0603]  -126.2 11.98 0 top
R25  10K  [R0603]  -78.6 9.2 0 top
R26  10K  [R0603]  -75.18 9.2 0 top
R27  10K  [R0603]  -90.67 12.45 0 top
R28  10K  [R0603]  -23.84 10.47 0 top
R29  10K  [R0603]  -20.41 10.47 0 top
R30  10K  [R0603]  -30.68 10.47 0 top
R31  10K  [R0603]  -27.26 10.47 0 top
R32  10K  [R0603]  -37.53 10.47 0 top
R33  10K  [R0603]  -34.1 10.47 0 top
R34  10K  [R0603]  -44.37 10.47 0 top
R35  10K  [R0603]  -40.95 10.47 0 top
R36  10K  [R0603]  -71.75 10.47 0 top
R37  10K  [R0603]  -68.33 10.47 0 top
R38  10K  [R0603]  -64.91 10.47 0 top
R39  10K  [R0603]  -61.49 10.47 0 top
R40  10K  [R0603]  -58.06 10.47 0 top
R41  10K  [R0603]  -54.64 10.47 0 top
R42  10K  [R0603]  -51.22 10.47 0 top
R43  10K  [R0603]  -47.8 10.47 0 top
R44  10K  [R0603]  -100.99 -9.59 0 top
R45  10K  [R0603]  -97.57 -9.59 0 top
R46  10K  [R0603]  -94.09 -9.59 0 top
U1  TCA9548APWR  [TSSOP-24_L7.8-W4.4-P0.65-LS6.4-BL]  -84.62 1.94 0 top
U2  AMS1117-3.3  [SOT-89_L4.5-W2.5-P1.50-LS4.2-BR]  25 -0.93 0 top
U3  CH344Q  [LQFP-48_L7.0-W7.0-P0.50-LS9.0-BL]  11.47 -32.71 0 top
U4  74HC138  [SOP-16_L10.0-W3.9-P1.27-LS6.0-BL]  -118.76 9.44 0 top
U5  THS103J  [SW-SMD_6P-L5.4-W5.4-P1.27-LS5.6]  -105.78 -4.41 0 top
USB1  TYPE-C 16P CB1.6 073  [USB-C-SMD_SHOU_TYPE-C-16P-CB1.6]  4.45 4.78 0 top
X2  8MHz  [CRYSTAL-SMD_4P-L3.2-W2.5-BL]  -4.28 -50.48 0 top

## Footprints (pads in the part's own frame, mm; a bottom-side part is the same pattern mirrored in y, then rotated)
C0603
  rect 0.8x0.9 smd: 1(-0.7,0) 2(0.7,0)
C0805
  rect 1.41x1.35 smd: 1(-1,0) 2(1,0)
CRYSTAL-SMD_4P-L3.2-W2.5-BL
  rect 1.4x1.2 smd: 1(-1.1,-0.85) 2(1.1,-0.85) 3(1.1,0.85) 4(-1.1,0.85)
F1206
  rect 1.19x1.728 smd: 1(-1.445,0) 2(1.445,0)
LED0603-RD
  rect 0.8x0.8 smd: 1(-0.799,0) 2(0.799,0)
LED0603-RD_1
  rect 0.9x1 smd: 1(-0.85,0) 2(0.85,0)
LED0603-RD_RED
  rect 0.8x0.8 smd: 1(-0.799,-0.004) 2(0.799,0.004)
LQFP-48_L7.0-W7.0-P0.50-LS9.0-BL
  oval 0.27x1.5 smd: 1(-2.75,-4.25) 2(-2.25,-4.25) 3(-1.75,-4.25) 4(-1.25,-4.25) 5(-0.75,-4.25) 6(-0.25,-4.25) 7(0.25,-4.25) 8(0.75,-4.25) 9(1.25,-4.25) 10(1.75,-4.25) 11(2.25,-4.25) 12(2.75,-4.25) 25(2.75,4.25) 26(2.25,4.25) 27(1.75,4.25) 28(1.25,4.25) 29(0.75,4.25) 30(0.25,4.25) 31(-0.25,4.25) 32(-0.75,4.25) 33(-1.25,4.25) 34(-1.75,4.25) 35(-2.25,4.25) 36(-2.75,4.25)
  oval 1.5x0.27 smd: 13(4.25,-2.75) 14(4.25,-2.25) 15(4.25,-1.75) 16(4.25,-1.25) 17(4.25,-0.75) 18(4.25,-0.25) 19(4.25,0.25) 20(4.25,0.75) 21(4.25,1.25) 22(4.25,1.75) 23(4.25,2.25) 24(4.25,2.75) 37(-4.25,2.75) 38(-4.25,2.25) 39(-4.25,1.75) 40(-4.25,1.25) 41(-4.25,0.75) 42(-4.25,0.25) 43(-4.25,-0.25) 44(-4.25,-0.75) 45(-4.25,-1.25) 46(-4.25,-1.75) 47(-4.25,-2.25) 48(-4.25,-2.75)
PAD_S_2.54_2*6
  oval 1.02x3.5 smd: 1(-6.35,0) 2(-3.81,0) 3(-1.27,0) 4(1.27,0) 5(3.81,0) 6(6.35,0)
  oval 1.02x3.5 smd far side: 7(-6.35,0) 8(-3.81,0) 9(-1.27,0) 10(1.27,0) 11(3.81,0) 12(6.35,0)
R0603
  rect 0.806x0.864 smd: 1(-0.753,0) 2(0.753,0)
SOP-16_L10.0-W3.9-P1.27-LS6.0-BL
  oval 0.56x1.745 smd: 1(-4.445,-2.873) 2(-3.175,-2.873) 3(-1.905,-2.873) 4(-0.635,-2.873) 5(0.635,-2.873) 6(1.905,-2.873) 7(3.175,-2.873) 8(4.445,-2.873) 9(4.445,2.873) 10(3.175,2.873) 11(1.905,2.873) 12(0.635,2.873) 13(-0.635,2.873) 14(-1.905,2.873) 15(-3.175,2.873) 16(-4.445,2.873)
SOT-89_L4.5-W2.5-P1.50-LS4.2-BR
  rect 1.575x0.672 smd: 1(1.356,-1.5) 3(1.356,1.5)
  custom 5.377x1.9 smd: 2(-1.356,0.009)
SW-SMD_6P-L5.4-W5.4-P1.27-LS5.6
  rect 0.762x2.65 smd: 1(-1.27,-2.625) 2(0,-2.625) 3(1.27,-2.625) 4(1.27,2.625) 5(0,2.625) 6(-1.27,2.625)
TSSOP-24_L7.8-W4.4-P0.65-LS6.4-BL
  rect 0.4x1.65 smd: 1(-3.575,-3.022) 2(-2.925,-3.022) 3(-2.275,-3.022) 4(-1.625,-3.022) 5(-0.975,-3.022) 6(-0.325,-3.022) 7(0.325,-3.022) 8(0.975,-3.022) 9(1.625,-3.022) 10(2.275,-3.022) 11(2.925,-3.022) 12(3.575,-3.022) 13(3.575,3.022) 14(2.925,3.022) 15(2.275,3.022) 16(1.625,3.022) 17(0.975,3.022) 18(0.325,3.022) 19(-0.325,3.022) 20(-0.975,3.022) 21(-1.625,3.022) 22(-2.275,3.022) 23(-2.925,3.022) 24(-3.575,3.022)
USB-C-SMD_SHOU_TYPE-C-16P-CB1.6
  oval 1x1.7 hole 0.6x1.3: 25(5.62,1.425) 28(-5.62,1.425)
  oval 1x2.1 hole 0.6x1.7: 26(5.62,-2.575) 27(-5.62,-2.575)
  rect 0.3x1.1 smd: A1(-3.35,2.575) A4(-2.55,2.575) A5(-1.25,2.575) A6(-0.25,2.575) A7(0.25,2.575) A8(1.25,2.575) A9(2.55,2.575) A12(3.35,2.575) B1(3.05,2.575) B4(2.25,2.575) B5(1.75,2.575) B6(0.75,2.575) B7(-0.75,2.575) B8(-1.75,2.575) B9(-2.25,2.575) B12(-3.05,2.575)

## Nets
As in the schematic.

Pads without a net: U3 1 2 3 4 10 11 14 17 18 19 25 26 27 28 29 32 33 34 39 40 41 45 46; USB1 A8 B8
